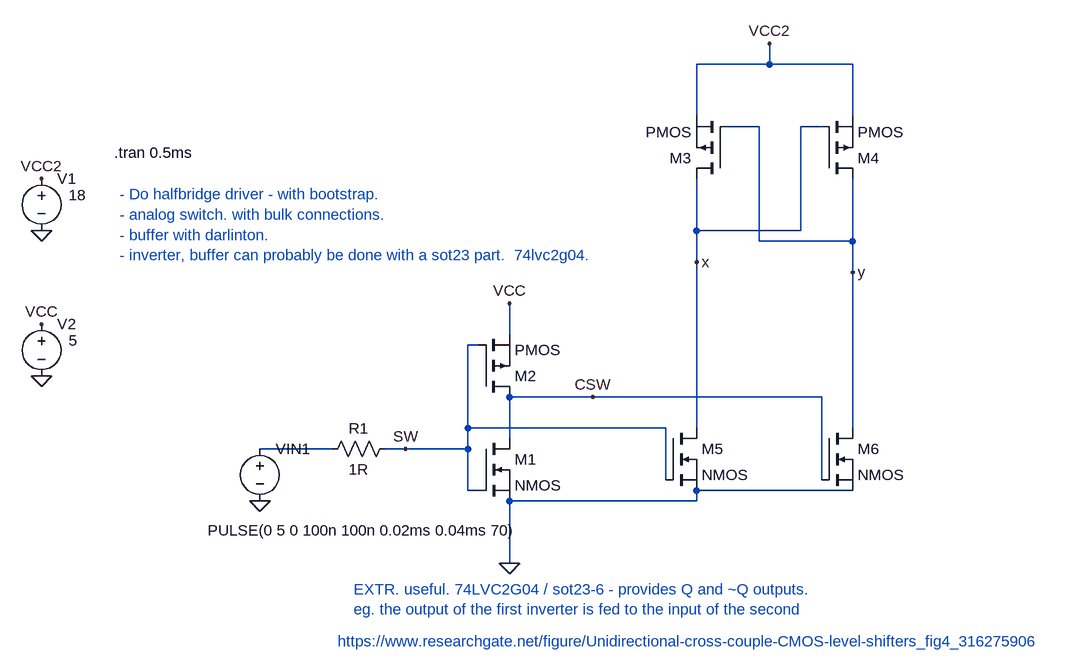
[diagram p0: schematic Draft62.asc]
Draft62.asc, the LTspice schematic file:
Version 4
SHEET 1 2756 1020
WIRE 1104 -256 1104 -288
WIRE 1104 -256 992 -256
WIRE 1232 -256 1104 -256
WIRE 992 -176 992 -256
WIRE 1232 -176 1232 -256
WIRE 1088 -160 1040 -160
WIRE 1184 -160 1152 -160
WIRE 992 0 992 -80
WIRE 1152 0 1152 -160
WIRE 1152 0 992 0
WIRE 1088 16 1088 -160
WIRE 1232 16 1232 -80
WIRE 1232 16 1088 16
WIRE 992 48 992 0
WIRE 1232 64 1232 16
WIRE 704 160 704 112
WIRE 656 176 640 176
WIRE 832 256 704 256
WIRE 1184 256 832 256
WIRE 640 304 640 176
WIRE 944 304 640 304
WIRE 992 304 992 48
WIRE 1232 304 1232 64
WIRE 704 320 704 256
WIRE 432 336 320 336
WIRE 544 336 512 336
WIRE 640 336 640 304
WIRE 640 336 544 336
WIRE 944 384 944 304
WIRE 1184 384 1184 256
WIRE 640 400 640 336
WIRE 656 400 640 400
WIRE 1232 400 992 400
WIRE 992 416 992 400
WIRE 992 416 704 416
WIRE 704 512 704 416
FLAG -16 0 0
FLAG -16 -80 VCC2
FLAG 544 336 SW
FLAG 320 416 0
FLAG 832 256 CSW
FLAG 704 512 0
FLAG -16 224 0
FLAG -16 144 VCC
FLAG 704 112 VCC
FLAG 1104 -288 VCC2
FLAG 992 48 x
FLAG 1232 64 y
SYMBOL voltage -16 -96 R0
WINDOW 123 0 0 Left 0
WINDOW 39 0 0 Left 0
WINDOW 3 42 41 Left 2
SYMATTR Value 18
SYMATTR InstName V1
SYMBOL voltage 320 320 R0
WINDOW 123 0 0 Left 0
WINDOW 39 0 0 Left 0
WINDOW 3 -80 141 Left 2
SYMATTR Value PULSE(0 5 0 100n 100n 0.02ms 0.04ms 70)
SYMATTR InstName VIN1
SYMBOL nmos 656 320 R0
SYMATTR InstName M1
SYMBOL pmos 656 256 M180
SYMATTR InstName M2
SYMBOL voltage -16 128 R0
WINDOW 123 0 0 Left 0
WINDOW 39 0 0 Left 0
WINDOW 3 42 41 Left 2
SYMATTR Value 5
SYMATTR InstName V2
SYMBOL nmos 944 304 R0
SYMATTR InstName M5
SYMBOL nmos 1184 304 R0
SYMATTR InstName M6
SYMBOL res 528 320 R90
WINDOW 0 0 56 VBottom 2
WINDOW 3 32 56 VTop 2
SYMATTR InstName R1
SYMATTR Value 1R
SYMBOL pmos 1040 -80 R180
SYMATTR InstName M3
SYMBOL pmos 1184 -80 M180
SYMATTR InstName M4
TEXT 96 -120 Left 2 !.tran 0.5ms
TEXT 440 632 Left 2 ;https://www.researchgate.net/figure/Unidirectional-cross-couple-CMOS-level-shifters_fig4_316275906
TEXT 104 -56 Left 2 ;- Do halfbridge driver - with bootstrap.\n- analog switch. with bulk connections.\n- buffer with darlinton.\n- inverter, buffer can probably be done with a sot23 part.  74lvc2g04.
TEXT 464 552 Left 2 ;EXTR. useful. 74LVC2G04 / sot23-6 - provides Q and ~Q outputs.  \neg. the output of the first inverter is fed to the input of the second

The netlist it stands for:
* Draft62.asc
V1 VCC2 0 18
VIN1 N001 0 PULSE(0 5 0 100n 100n 0.02ms 0.04ms 70)
M1 CSW SW 0 0 NMOS
M2 CSW SW VCC VCC PMOS
V2 VCC 0 5
M5 x SW 0 0 NMOS
M6 y CSW 0 0 NMOS
R1 SW N001 1R
M3 x y VCC2 VCC2 PMOS
M4 y x VCC2 VCC2 PMOS
.model NMOS NMOS
.model PMOS PMOS
.lib standard.mos
.tran 0.5ms
* https://www.researchgate.net/figure/Unidirectional-cross-couple-CMOS-level-shifters_fig4_316275906
* - Do halfbridge driver - with bootstrap.
* - analog switch. with bulk connections.
* - buffer with darlinton.
* - inverter, buffer can probably be done with a sot23 part.  74lvc2g04.
* EXTR. useful. 74LVC2G04 / sot23-6 - provides Q and ~Q outputs.
* eg. the output of the first inverter is fed to the input of the second
.backanno
.end